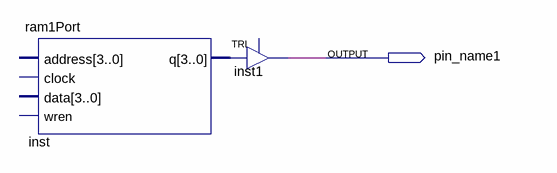
[diagram p0: schematic sheet]
// Quartus schematic LPM.bdf as structural Verilog: 2 symbols, 1 pins
module LPM (
  output pin_name1
);

  wire [3:0] inst_q;

  ram1Port inst (.q(inst_q));  // open: address, clock, data, wren
  TRI inst1[3:0] (.IN(inst_q), .OUT(pin_name1));  // open: OE
endmodule
